# EAGLE design SI4735 (EAGLE 9.6.2)
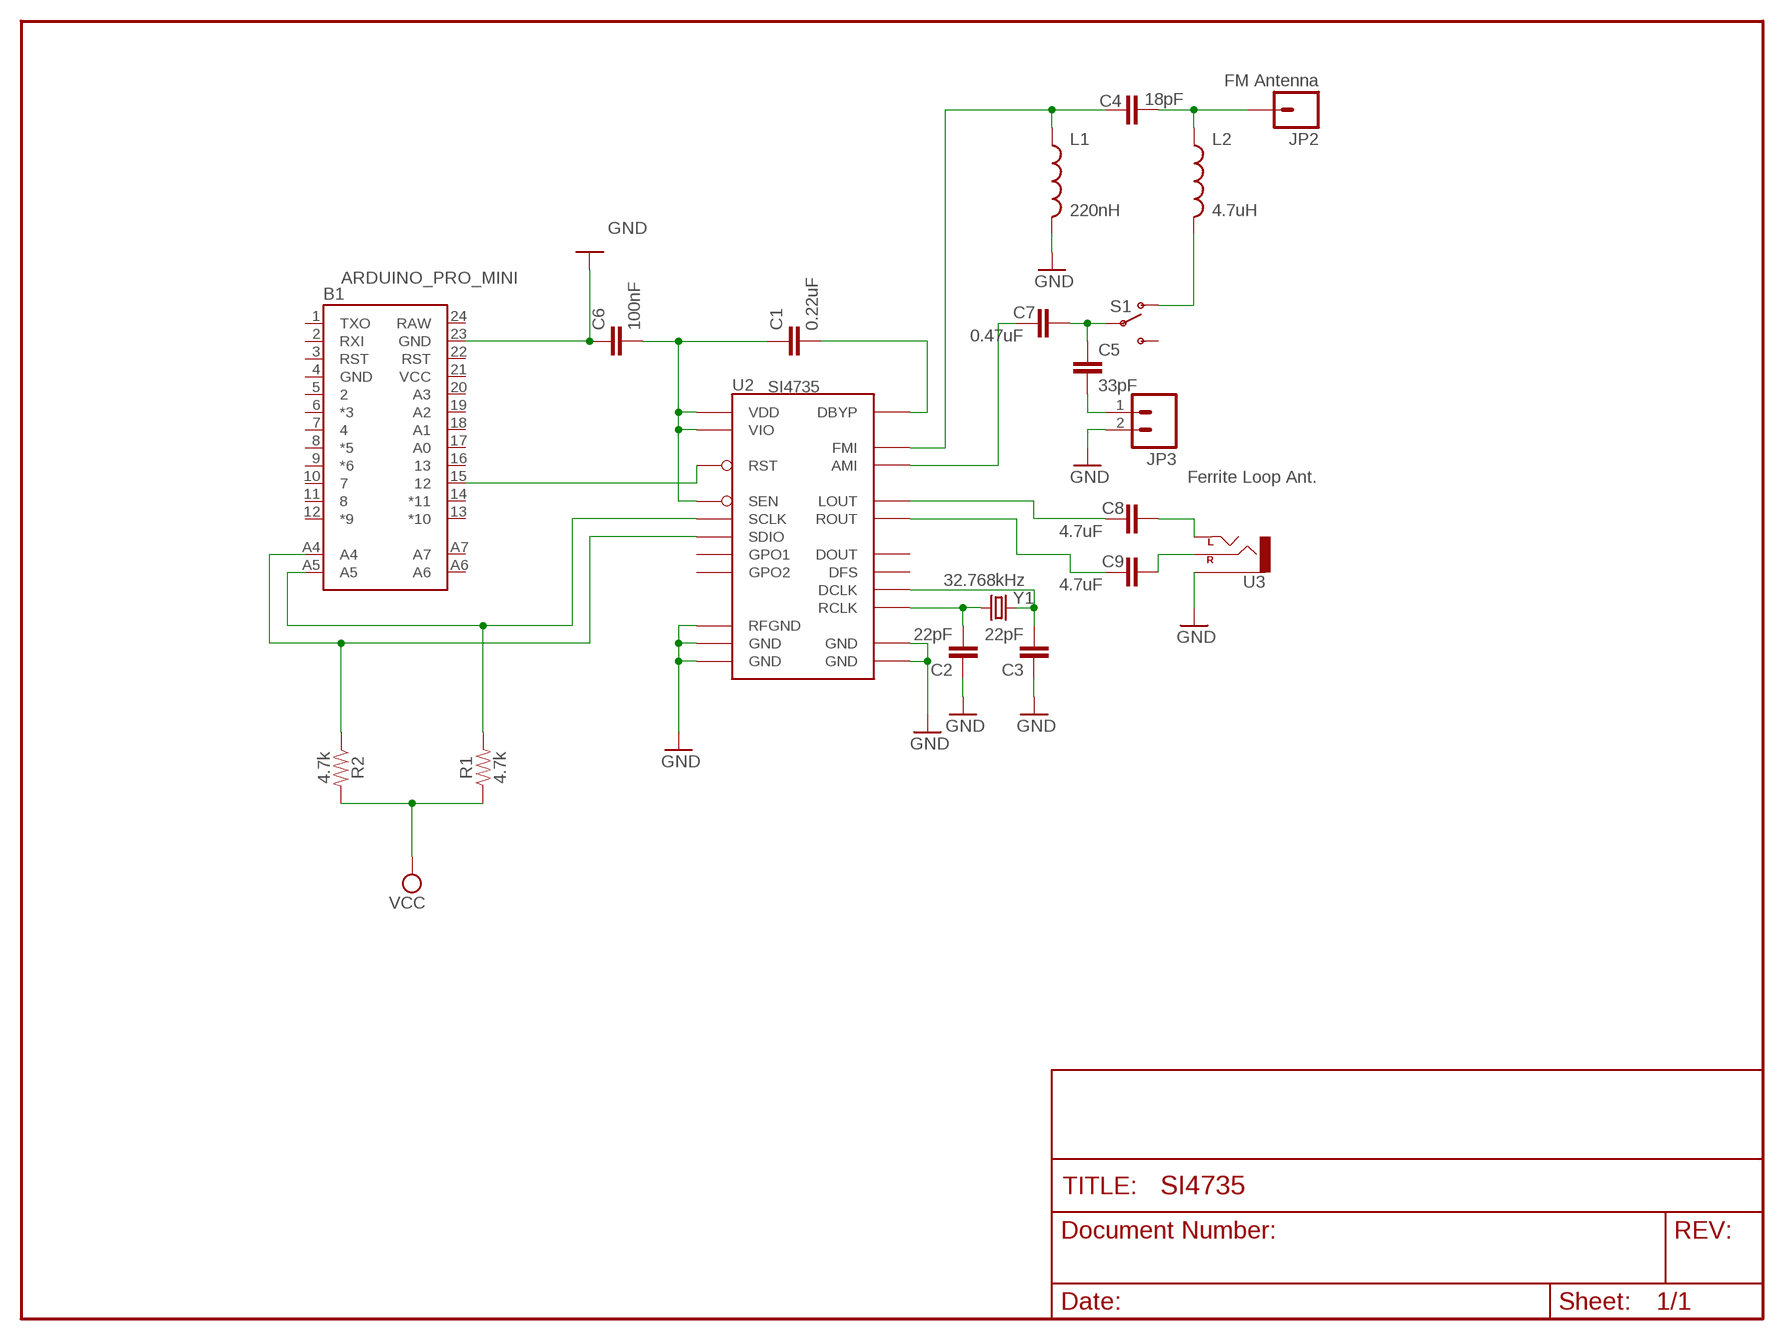
[diagram p0: schematic, sheet 1]

## Parts
B1  ARDUINO_PRO_MINI  [ARDUINO_PRO_MINI]
C1  0.22uF  CAP0402-CAP  [0402-CAP]
C2  22pF  CAP0402-CAP  [0402-CAP]
C3  22pF  CAP0402-CAP  [0402-CAP]
C4  18pF  CAP0402-CAP  [0402-CAP]
C5  33pF  CAP0402-CAP  [0402-CAP]
C6  100nF  CAP0402-CAP  [0402-CAP]
C7  0.47uF  CAP0402-CAP  [0402-CAP]
C8  4.7uF  CAP0402-CAP  [0402-CAP]
C9  4.7uF  CAP0402-CAP  [0402-CAP]
JP2  FM Antenna  M01PTH  [1X01]
JP3  Ferrite Loop Ant.  M02PTH  [1X02]
L1  220nH  INDUCTOR0402  [C0402]
L2  4.7uH  INDUCTOR0402  [C0402]
R1  4.7k  4.7KOHM-0603-1/10W-1%  [0603]
R2  4.7k  4.7KOHM-0603-1/10W-1%  [0603]
S1  SWITCH-SPSTSMD  [AYZ0202]
U2  SI4735  [SSOP24_NARROW]
U3  AUDIO-JACKSMD2  [AUDIO-JACK-3.5MM-SMD]
Y1  32.768kHz  CRYSTAL32-SMD  [CRYSTAL-32kHz-SMD]

## Nets
GND: B1.23(GND) C2.1 C3.1 C6.1 JP3.2 L1.2 U2.9(RFGND) U2.10(GND) U2.11(GND) U2.13(GND) U2.14(GND) U3.SLEEVE
N$1: C2.2 U2.19(RCLK) Y1.X1
N$2: C3.2 U2.3(DCLK) Y1.X2
N$3: B1.15 U2.15(RST)
N$4: C1.2 U2.22(DBYP)
N$5: B1.A5 R1.2 U2.17(SCLK)
N$12: B1.A4 R2.1 U2.18(SDIO)
N$17: C4.1 L1.1 U2.8(FMI)
N$21: C4.2 JP2.1 L2.1
N$22: L2.2 S1.1(O)
N$23: C5.1 C7.1 S1.2(P)
N$34: C7.2 U2.12(AMI)
N$35: C5.2 JP3.1
N$48: C9.1 U3.RING(RIGHT)
N$49: C8.1 U3.TIP(LEFT)
N$50: C8.2 U2.24(LOUT)
N$51: C9.2 U2.23(ROUT)
RAD_PWR: C1.1 C6.2 U2.16(SEN) U2.20(VIO) U2.21(VDD)
VCC: R1.1 R2.2
Unconnected: B1.1(TXO) B1.2(RXI) B1.3(RST) B1.5 B1.6(*3) B1.7 B1.8(*5) B1.9(*6) B1.10 B1.11 B1.12(*9) B1.13(*10) B1.14(*11) B1.16 B1.17(A0) B1.18(A1) B1.19(A2) B1.20(A3) B1.22(RST) B1.A6 B1.A7 S1.3(S) U2.1(DOUT) U2.2(DFS) U2.4(GPO2) U2.5(GPO1)

## Power pins joined to a net without a drawn wire
GND: B1.4(GND)
RAW: B1.24(RAW)
VCC: B1.21(VCC)

## Library data of the parts
B1 = SparkFun-Boards:ARDUINO_PRO_MINI: SparkFun Pro Mini Pro Mini compatible footprint. Dimensions: 0.7 x 1.3" PCB Thickness: 0.8mm SparkFun Products: 3.3V/8MHz <https://www.sparkfun.com/products/11114> 5V/16MHz <https://www.sparkfun.com/products/11113>
C1-C9 = SparkFun:CAP: Capacitor Standard 0603 ceramic capacitor, and 0.1" leaded capacitor.
JP2 = SparkFun:M01: Header 1 Standard 1-pin 0.1" header. Use with straight break away headers (SKU : PRT-00116), right angle break away headers (PRT-00553), swiss pins (PRT-00743), machine pins (PRT-00117), and female headers (PRT-00115).
JP3 = SparkFun:M02: Header 2 Standard 2-pin 0.1" header. Use with straight break away headers (SKU : PRT-00116), right angle break away headers (PRT-00553), swiss pins (PRT-00743), machine pins (PRT-00117), and female headers (PRT-00115). Molex polarized connector foot print use with SKU : PRT-08233 with associated crimp pins and housings.
L1 L2 = SparkFun:INDUCTOR: Inductors Basic Inductor/Choke - 0603 and 1206. Footprints are not proven and vary greatly between part numbers.
R1 R2 = SparkFun-Resistors:4.7KOHM: 4.7kΩ resistor A resistor is a passive two-terminal electrical component that implements electrical resistance as a circuit element. Resistors act to reduce current flow, and, at the same time, act to lower voltage levels within circuits. - Wikipedia; PROD_ID: RES-07857
S1 = SparkFun:SWITCH-SPST: SPST Switch Simple slide switch. Spark Fun Electronics SKU : COM-00102
U2 = SparkFun:SI4735: Radio chip that covers FM broadcast with RDS, plus a bunch of shortwave and logwave frequencies
U3 = SparkFun:AUDIO-JACK: 3.5mm Audio Jack Simple 3.5mm common PCB mount audio jack. SKU: PRT-08032
Y1 = SparkFun:CRYSTAL: Crystals Various standard crystals. Proven footprints. Spark Fun Electronics SKU : COM-00534

## Board
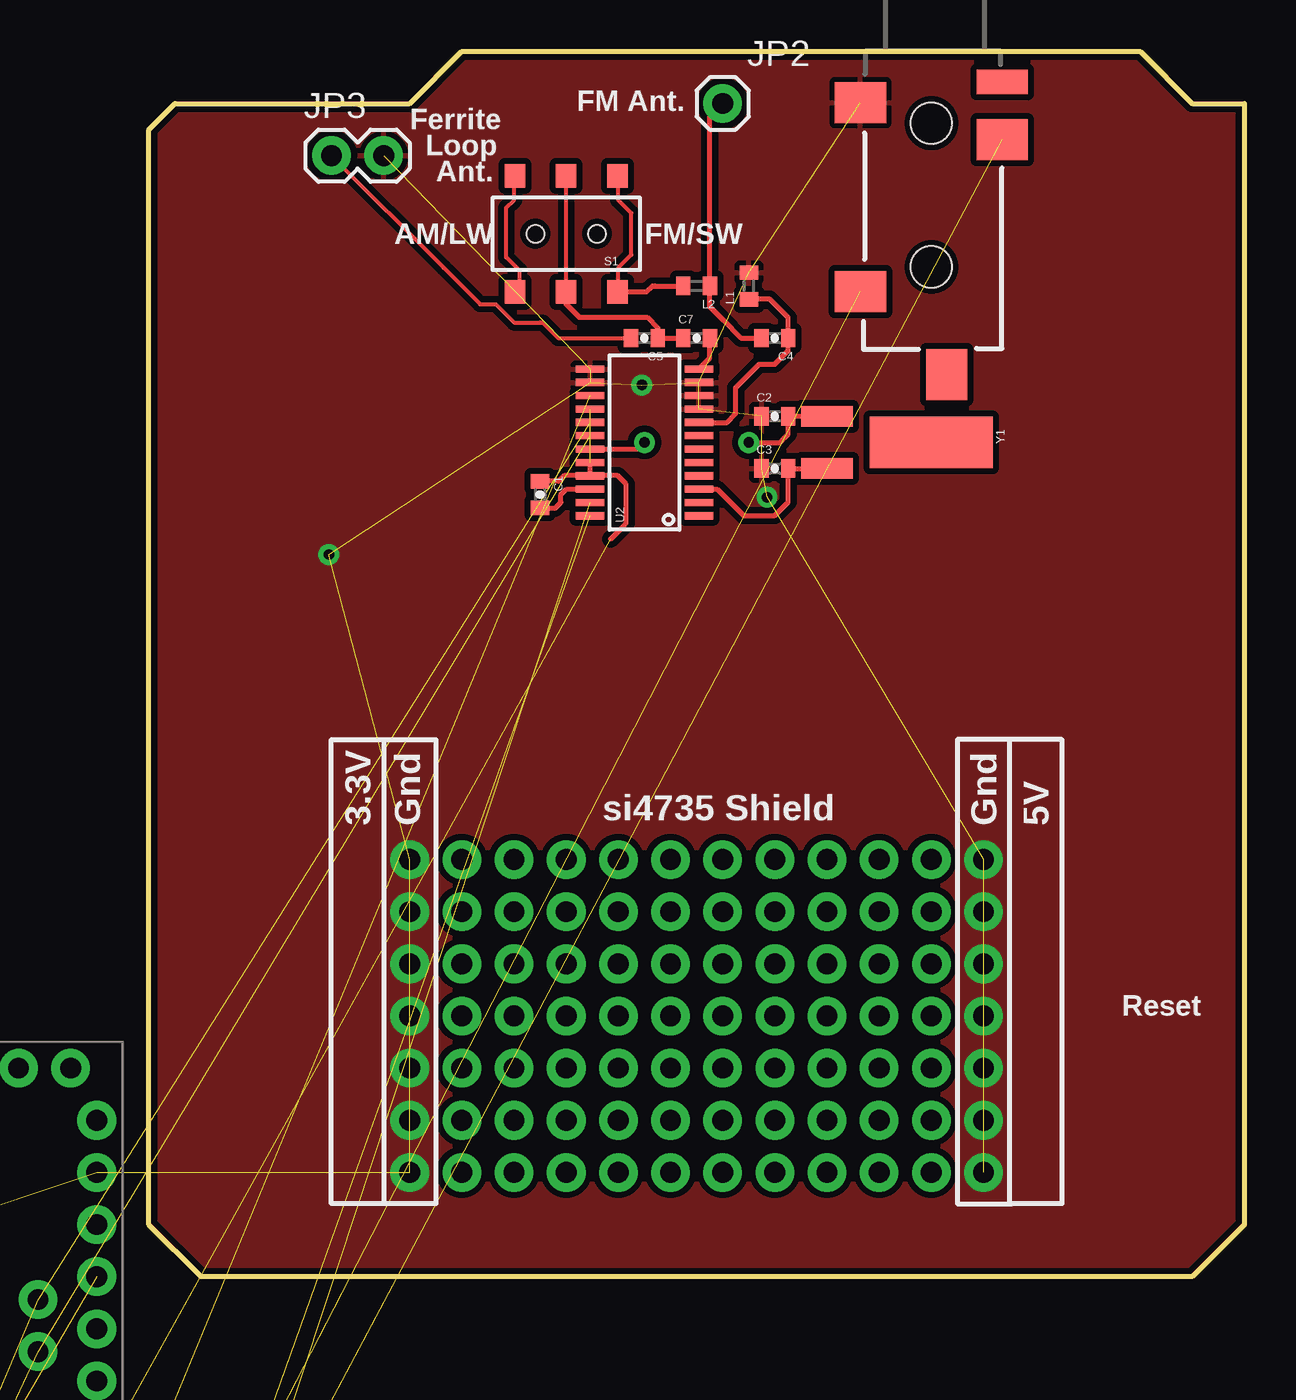
[diagram p1: board, top side]
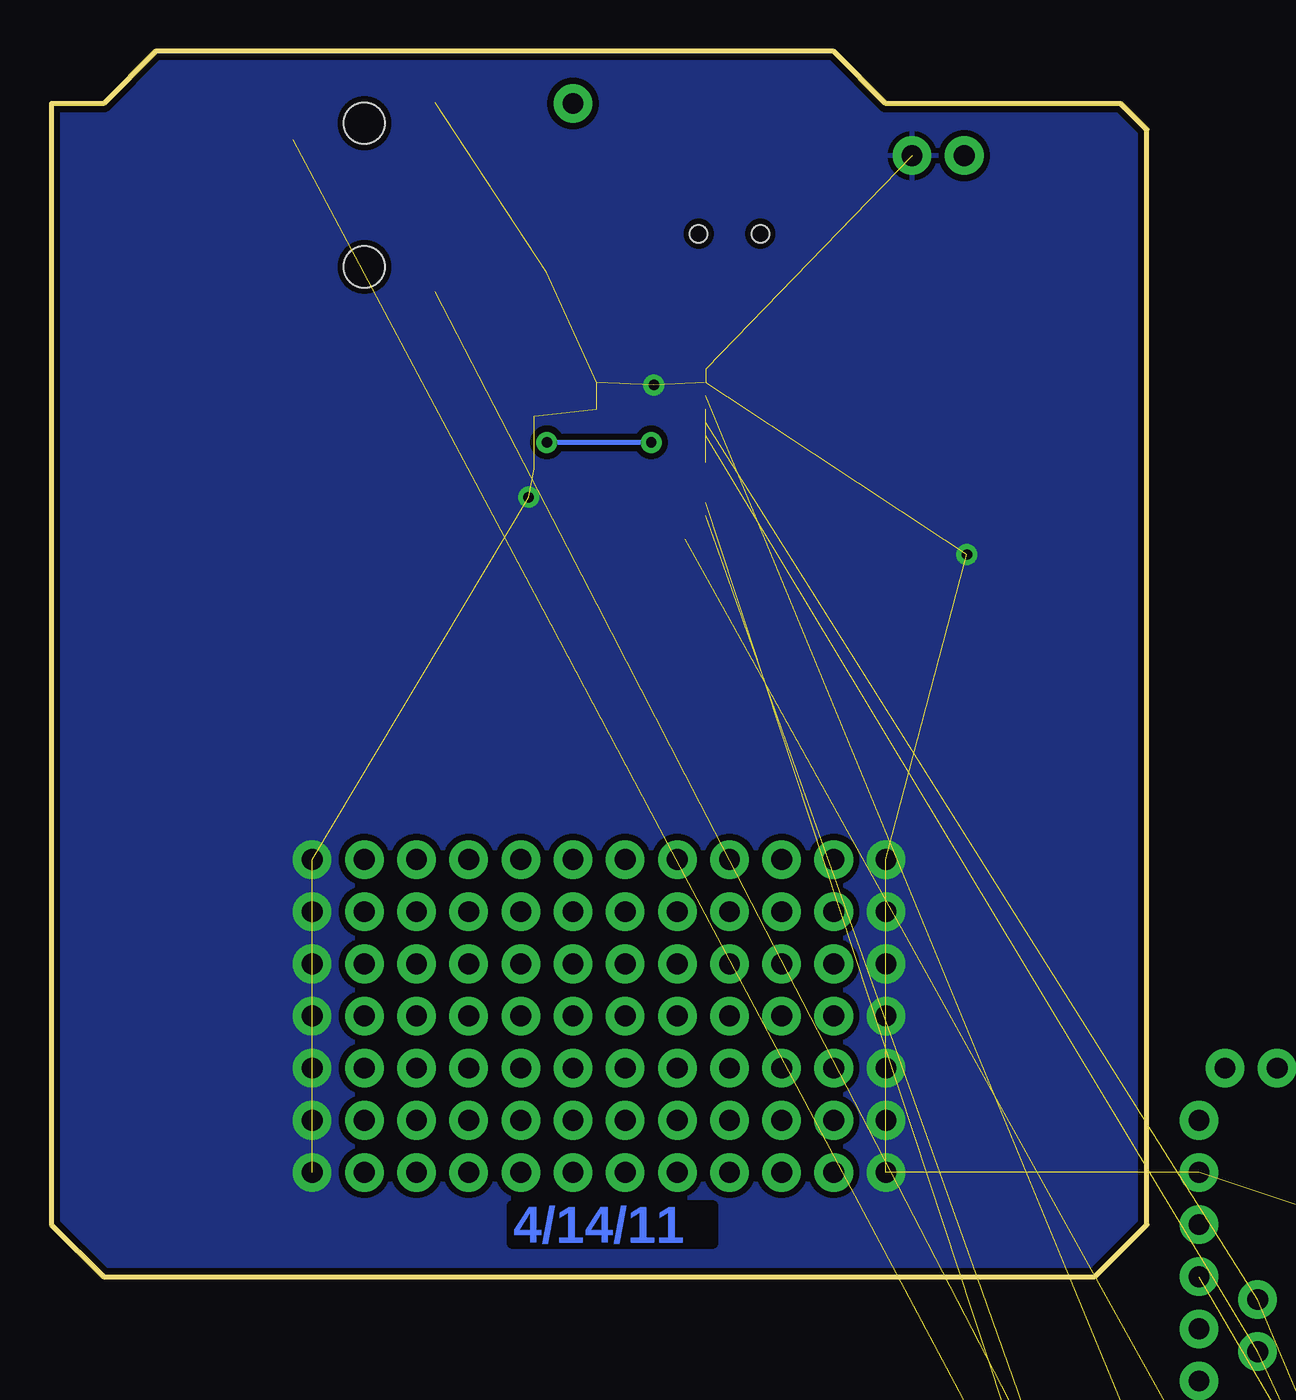
[diagram p2: board, bottom side, seen from below]

Size 53.34 x 59.69 mm. Coordinates in mm from the lower left corner, seen from the top.
Outline: 0,2.54 0,55.88 1.27,57.15 12.7,57.15 15.24,59.69 48.26,59.69 50.8,57.15 53.34,57.15 53.34,2.54 50.8,0 2.54,0 0,2.54
Copper layers (1*16): Top 0.035mm / dielectric 1.5mm / Bottom 0.035mm
Design rules "SparkFun": minimum track width 8mil, minimum drill 20mil, track to track 8mil, track to pad 8mil, pad to pad 8mil, via to via 8mil, smd to smd 8mil, copper to edge 8mil, drill to drill 8mil, minimum pad ring 12mil, minimum via ring 10mil, stop-mask expansion 4mil, vias tented up to drill 20mil, thermal gap 10mil

### Footprints (pad centres in the part's own frame; a part is rotated, then mirrored left to right if it is on the bottom)
ARDUINO_PRO_MINI = drill 1.016 pad 1.88: 1 -7.62,12.7; 2 -7.62,10.16; 3 -7.62,7.62; 4 -7.62,5.08; 5 -7.62,2.54; 6 -7.62,0; 7 -7.62,-2.54; 8 -7.62,-5.08; 9 -7.62,-7.62; 10 -7.62,-10.16; 11 -7.62,-12.7; 12 -7.62,-15.24; 13 7.62,-15.24; 14 7.62,-12.7; 15 7.62,-10.16; 16 7.62,-7.62; 17 7.62,-5.08; 18 7.62,-2.54; 19 7.62,0; 20 7.62,2.54; 21 7.62,5.08; 22 7.62,7.62; 23 7.62,10.16; 24 7.62,12.7; A4 4.763,1.429; A5 4.763,3.969; A6 4.763,-9.049; A7 4.763,-6.509; BLK -6.35,15.24; GND -3.81,15.24; GRN 6.35,15.24; RXI 1.27,15.24; TXO 3.81,15.24; VCC -1.27,15.24
0402-CAP = smd 0.7 x 0.9: 1 -0.65,0; 2 0.65,0
1X01 = drill 1.016 pad 1.88: 1 0,0
1X02 = drill 1.016 pad 1.88: 1 0,0; 2 2.54,0
C0402 = smd 0.7 x 0.9: 1 -0.65,0; 2 0.65,0
0603 = smd 1.1 x 1: 1 -0.85,0; 2 0.85,0
AYZ0202 = smd 1 x 1.15: 1 -2.5,2.825; 2 0,2.825; 3 2.5,2.825; 4 -2.5,-2.825; 5 0,-2.825; 6 2.5,-2.825 | hole 0.85: 1.5,0; -1.5,0
SSOP24_NARROW = smd 0.348 x 1.397: 1 -3.575,-2.65; 2 -2.925,-2.65; 3 -2.275,-2.65; 4 -1.625,-2.65; 5 -0.975,-2.65; 6 -0.325,-2.65; 7 0.325,-2.65; 8 0.975,-2.65; 9 1.625,-2.65; 10 2.275,-2.65; 11 2.925,-2.65; 12 3.575,-2.65; 13 3.575,2.65; 14 2.925,2.65; 15 2.275,2.65; 16 1.625,2.65; 17 0.975,2.65; 18 0.325,2.65; 19 -0.325,2.65; 20 -0.975,2.65; 21 -1.625,2.65; 22 -2.275,2.65; 23 -2.925,2.65; 24 -3.575,2.65
AUDIO-JACK-3.5MM-SMD = smd 2 x 2.5: RING 4.3,3.45; SLEEVE 2.5,-3.45; TIP 11.7,-3.45 | smd 1.2 x 2.5: RSH 1.5,3.45 | smd 2.5 x 2: TSH 15.75,0.75 | hole 2: 3.5,0; 10.5,0
CRYSTAL-32kHz-SMD = smd 2.5 x 6: SHEILD 0,5.08 | smd 1 x 2.5: X1 -1.27,0; X2 1.27,0

### Placement (x,y rotation side)
B1  -10.16,-5.08 0 top
C1  19.05,38.1 270 top
C2  30.48,41.91 0 top
C3  30.48,39.37 0 top
C4  30.48,45.72 180 top
C5  24.13,45.72 180 top
C6  -16.51,-33.02 0 top  (outside the outline)
C7  26.67,45.72 0 top
C8  1.27,-17.78 0 top  (outside the outline)
C9  1.27,-21.59 0 top  (outside the outline)
JP2  27.94,57.15 0 top
JP3  8.89,54.61 0 top
L1  29.21,48.26 90 top
L2  26.67,48.26 180 top
R1  -16.51,-25.4 0 top  (outside the outline)
R2  -16.51,-29.21 0 top  (outside the outline)
S1  20.32,50.8 180 top
U2  24.13,40.64 90 top
U3  38.1,59.69 270 top
Y1  33.02,40.64 270 top

### Tracks (layer width: path | path; a pad name or v marks a point on that pad's centre or on a via)
GND  (via drill 0.51, 1.02 pad 1.88)  (29 unrouted)
  other vias: 24,43.43 8.76,35.18 30.1,37.97 40.64,20.32 40.64,17.78 40.64,15.24 40.64,12.7 40.64,10.16 40.64,7.62 40.64,5.08 12.7,20.32 12.7,17.78 12.7,15.24 12.7,12.7 12.7,10.16 12.7,7.62 12.7,5.08
  pour Bottom (isolate 0.305): 0,0 0,59.69 53.34,59.69 53.34,0
  pour Top (isolate 0.305): 0,0 0,57.15 2.54,59.69 52.07,59.69 53.34,58.42 53.34,2.54 50.8,0
N$1  (via drill 0.51)
  Top 0.254: Y1.X1 32.89,41.91 C2.2 31.13,41.04 30.99,40.89 30.73,40.64 v29.21,40.64 | U2.19 23.8,40.31 v24.13,40.64
  Bottom 0.254: v24.13,40.64 v29.21,40.64
N$2
  Top 0.254: Y1.X2 C3.2 31.13,37.73 31.11,37.72 30.73,37.34 30.48,37.08 28.96,37.08 27.68,38.37 U2.3
N$3  (1 unrouted)
N$4
  Top 0.254: C1.2 19.8,37.45 20.07,37.72 20.07,38.1 20.33,38.37 U2.22
N$5  (2 unrouted)
N$6  (via drill 1.02 pad 1.88)
  other vias: 15.24,5.08
N$7  (via drill 1.02 pad 1.88)
  other vias: 17.78,5.08
N$8  (via drill 1.02 pad 1.88)
  other vias: 20.32,5.08
N$9  (via drill 1.02 pad 1.88)
  other vias: 22.86,5.08
N$10  (via drill 1.02 pad 1.88)
  other vias: 25.4,5.08
N$11  (via drill 1.02 pad 1.88)
  other vias: 27.94,5.08
N$12  (2 unrouted)
N$13  (via drill 1.02 pad 1.88)
  other vias: 30.48,5.08
N$14  (via drill 1.02 pad 1.88)
  other vias: 33.02,5.08
N$17
  Top 0.254: L1.1 30.24,47.61 31.11,46.74 31.13,46.72 C4.1 31.13,45.1 31.11,45.09 30.48,44.45 29.72,44.45 28.57,43.31 28.57,42.04 28.15,41.62 U2.8
N$18  (via drill 1.02 pad 1.88)
  other vias: 35.56,5.08
N$19  (via drill 1.02 pad 1.88)
  other vias: 38.1,5.08
N$21
  Top 0.254: C4.2 29.72,45.72 28.83,45.72 27.94,46.61 27.3,47.24 27.3,48.26 L2.1 27.32,56.53 JP2.1
N$22
  Top 0.254: S1.1 24.23,47.98 24.51,48.26 24.64,48.26 L2.2
N$23
  Top 0.203: 20.32,47.88 20.32,53.59
  Top 0.254: C7.1 26.04,45.72 C5.1 24.78,46.21 24.26,46.74 24.13,46.74 20.95,46.74 20.32,47.37 20.32,47.88 S1.2
N$24  (via drill 1.02 pad 1.88)
  other vias: 38.1,7.62
N$25  (via drill 1.02 pad 1.88)
  other vias: 35.56,7.62
N$26  (via drill 1.02 pad 1.88)
  other vias: 33.02,7.62
N$27  (via drill 1.02 pad 1.88)
  other vias: 30.48,7.62
N$28  (via drill 1.02 pad 1.88)
  other vias: 27.94,7.62
N$29  (via drill 1.02 pad 1.88)
  other vias: 25.4,7.62
N$30  (via drill 1.02 pad 1.88)
  other vias: 22.86,7.62
N$31  (via drill 1.02 pad 1.88)
  other vias: 20.32,7.62
N$32  (via drill 1.02 pad 1.88)
  other vias: 17.78,7.62
N$33  (via drill 1.02 pad 1.88)
  other vias: 15.24,7.62
N$34
  Top 0.254: C7.2 27.3,45.72 27.3,44.74 U2.12
N$35
  Top 0.203: C5.2 19.94,45.72 19.18,46.48 19.05,46.48 17.78,46.48 16.89,47.37 16.64,47.37 16.13,47.37 14.35,49.15 JP3.1
N$36
  Top 0.203: 18.03,48.01 18.03,49.02 17.4,49.66 17.4,52.07 17.78,52.45 17.78,53.59
N$37
  Top 0.203: 22.86,48.01 22.86,49.15 23.5,49.78 23.5,51.82 22.86,52.45 22.86,53.72
N$38  (via drill 1.02 pad 1.88)
  other vias: 15.24,10.16
N$39  (via drill 1.02 pad 1.88)
  other vias: 17.78,10.16
N$40  (via drill 1.02 pad 1.88)
  other vias: 20.32,10.16
N$41  (via drill 1.02 pad 1.88)
  other vias: 22.86,10.16
N$42  (via drill 1.02 pad 1.88)
  other vias: 25.4,10.16
N$43  (via drill 1.02 pad 1.88)
  other vias: 27.94,10.16
N$44  (via drill 1.02 pad 1.88)
  other vias: 30.48,10.16
N$45  (via drill 1.02 pad 1.88)
  other vias: 33.02,10.16
N$46  (via drill 1.02 pad 1.88)
  other vias: 35.56,10.16
N$47  (via drill 1.02 pad 1.88)
  other vias: 38.1,10.16
N$48  (1 unrouted)
N$49  (1 unrouted)
N$50  (1 unrouted)
N$51  (1 unrouted)
N$52  (via drill 1.02 pad 1.88)
  other vias: 38.1,12.7
N$53  (via drill 1.02 pad 1.88)
  other vias: 35.56,12.7
N$54  (via drill 1.02 pad 1.88)
  other vias: 33.02,12.7
N$55  (via drill 1.02 pad 1.88)
  other vias: 30.48,12.7
N$56  (via drill 1.02 pad 1.88)
  other vias: 27.94,12.7
N$57  (via drill 1.02 pad 1.88)
  other vias: 25.4,12.7
N$58  (via drill 1.02 pad 1.88)
  other vias: 22.86,12.7
N$59  (via drill 1.02 pad 1.88)
  other vias: 20.32,12.7
N$60  (via drill 1.02 pad 1.88)
  other vias: 17.78,12.7
N$61  (via drill 1.02 pad 1.88)
  other vias: 15.24,12.7
N$66  (via drill 1.02 pad 1.88)
  other vias: 15.24,15.24
N$67  (via drill 1.02 pad 1.88)
  other vias: 17.78,15.24
N$68  (via drill 1.02 pad 1.88)
  other vias: 20.32,15.24
N$69  (via drill 1.02 pad 1.88)
  other vias: 22.86,15.24
N$70  (via drill 1.02 pad 1.88)
  other vias: 25.4,15.24
N$71  (via drill 1.02 pad 1.88)
  other vias: 27.94,15.24
N$72  (via drill 1.02 pad 1.88)
  other vias: 30.48,15.24
N$73  (via drill 1.02 pad 1.88)
  other vias: 33.02,15.24
N$74  (via drill 1.02 pad 1.88)
  other vias: 35.56,15.24
N$75  (via drill 1.02 pad 1.88)
  other vias: 38.1,15.24
N$80  (via drill 1.02 pad 1.88)
  other vias: 38.1,17.78
N$81  (via drill 1.02 pad 1.88)
  other vias: 35.56,17.78
N$82  (via drill 1.02 pad 1.88)
  other vias: 33.02,17.78
N$83  (via drill 1.02 pad 1.88)
  other vias: 30.48,17.78
N$84  (via drill 1.02 pad 1.88)
  other vias: 27.94,17.78
N$85  (via drill 1.02 pad 1.88)
  other vias: 25.4,17.78
N$86  (via drill 1.02 pad 1.88)
  other vias: 22.86,17.78
N$87  (via drill 1.02 pad 1.88)
  other vias: 20.32,17.78
N$88  (via drill 1.02 pad 1.88)
  other vias: 17.78,17.78
N$89  (via drill 1.02 pad 1.88)
  other vias: 15.24,17.78
N$94  (via drill 1.02 pad 1.88)
  other vias: 15.24,20.32
N$95  (via drill 1.02 pad 1.88)
  other vias: 20.32,20.32
N$96  (via drill 1.02 pad 1.88)
  other vias: 17.78,20.32
N$97  (via drill 1.02 pad 1.88)
  other vias: 22.86,20.32
N$98  (via drill 1.02 pad 1.88)
  other vias: 27.94,20.32
N$99  (via drill 1.02 pad 1.88)
  other vias: 25.4,20.32
N$100  (via drill 1.02 pad 1.88)
  other vias: 30.48,20.32
N$101  (via drill 1.02 pad 1.88)
  other vias: 33.02,20.32
N$102  (via drill 1.02 pad 1.88)
  other vias: 35.56,20.32
N$103  (via drill 1.02 pad 1.88)
  other vias: 38.1,20.32
RAD_PWR  (2 unrouted)
  Top 0.254: C1.1 19.95,38.75 20.07,38.86 20.22,39.02 U2.21 | U2.20 21.48,39.64 21.46,39.62 21.48,39.61 U2.21 | U2.21 22.83,39.02 23.24,38.61 23.24,38.35 23.24,36.7 23.11,36.58 22.48,35.94
VCC  (2 unrouted)

### Text on the board
Bottom: 4/14/11
tPlace: FM Ant. | Ferrite | Loop | Ant. | AM/LW | FM/SW | si4735 Shield | 3.3V | Gnd | Gnd | 5V | Reset